# Altium schematic sheet 24 to 12V regulator.SchDoc
size A
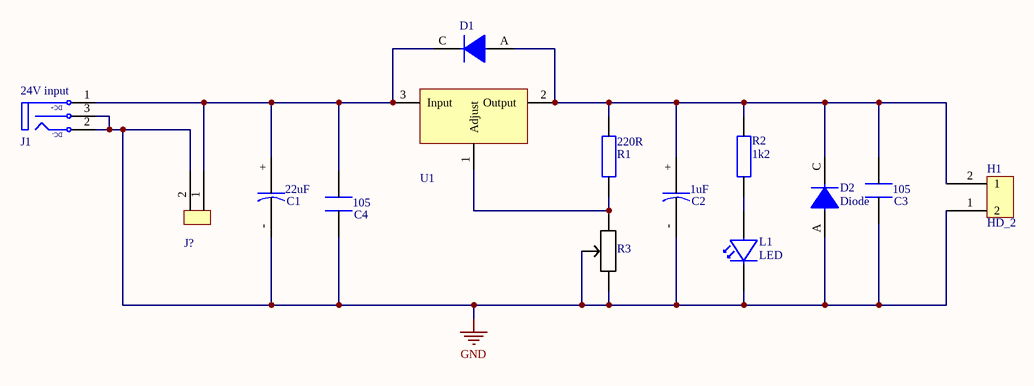
[diagram p0: 24 to 12V regulator.SchDoc]

## Parts
C1  22uF  [Pol_200mil]
C2  1uF  [Pol_200mil]
C3  105  [CAP_2]
C4  105  [CAP_2]
D1  Diode  [Diode]  (value not drawn)
D2  Diode  [Diode]
H1  HD_2  [Header 2]
J1  24V input  [JDC - 5.5]
J?  JP_2  [JP_2]  (value not drawn)
L1  LED  [LED-200mil]
R1  220R  [RES_VERTICAL]
R2  1k2  [RES_VERTICAL]
R3  POT_RES  [POT_5]  (value not drawn)
U1  LM317T  [LM317T]  (value not drawn)

## Nets
GND: C1.- C2.- C3.1 C4.1 D2.A H1.1(2) J1.2(DC+) J1.3(Shield) J?.2 L1.C R3.1 R3.2
NetC1_+: C1.+ C4.2 D1.C J1.1(DC+) J?.1 U1.3(Input)
NetC2_+: C2.+ C3.2 D1.A D2.C H1.2(1) R1.2 R2.1 U1.2(Output)
NetL1_A: L1.A R2.2
NetR1_1: R1.1 R3.3 U1.1(Adjust)

## Notes on the sheet
- (in symbol Jack DC - F) DC-

## Library data of the parts
C1 C2 = Pol-Cap: Tụ điện phân cực
C3 C4 = Cap
J1 = Jack DC - F
R1 R2 = RES: điện trở size nhỏ
R3 = POT_RES: Potentiometer
U1 = LM317T: A adjustable positive linear voltage regulator. Output voltage range: 1.25-37V. Difference voltage (Vo